# EAGLE design ThermocoupleTestBoard_2023_10_08_A (EAGLE 9.6.2)
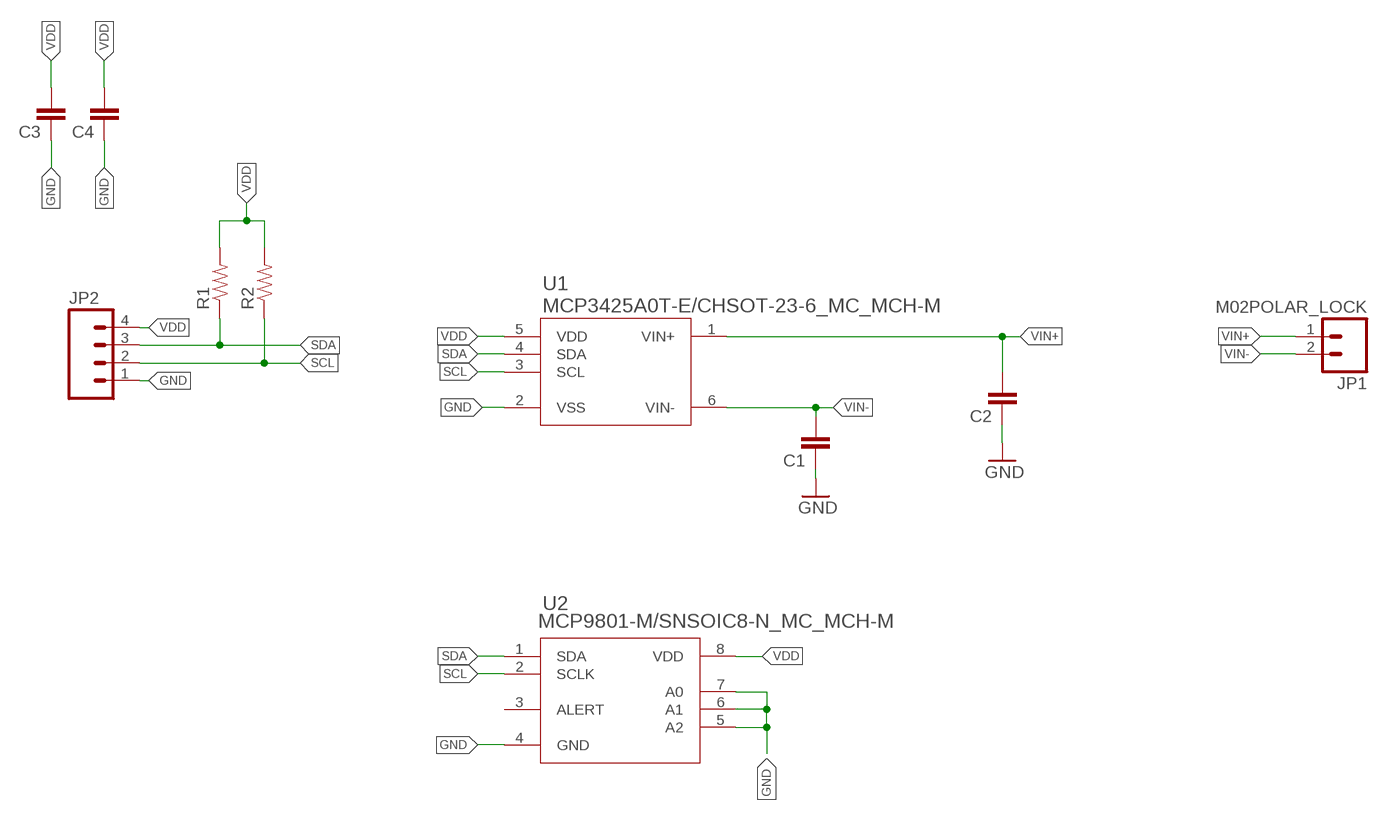
[diagram p0: schematic, sheet 1]

## Parts
C1  CAP1206  [1206]
C2  CAP1206  [1206]
C3  CAP1206  [1206]
C4  CAP1206  [1206]
JP1  M02POLAR_LOCK  [MOLEX-1X2_LOCK]
JP2  M04LOCK  [1X04_LOCK]
R1  RESISTOR1206  [1206]
R2  RESISTOR1206  [1206]
U1  MCP3425A0T-E/CHSOT-23-6_MC_MCH-M  [SOT-23-6_MC_MCH-M]
U2  MCP9801-M/SNSOIC8-N_MC_MCH-M  [SOIC8-N_MC_MCH-M]

## Nets
GND: C1.1 C2.1 C3.1 C4.1 JP2.1 U1.2(VSS) U2.4(GND) U2.5(A2) U2.6(A1) U2.7(A0)
SCL: JP2.2 R2.1 U1.3(SCL) U2.2(SCLK)
SDA: JP2.3 R1.1 U1.4(SDA) U2.1(SDA)
VDD: C3.2 C4.2 JP2.4 R1.2 R2.2 U1.5(VDD) U2.8(VDD)
VIN+: C2.2 JP1.1 U1.1(VIN+)
VIN-: C1.2 JP1.2 U1.6(VIN-)
Unconnected: U2.3(ALERT)

## Library data of the parts
C1-C4 = SparkFun-Capacitors:CAP: Capacitor Standard 0603 ceramic capacitor, and 0.1" leaded capacitor.
JP1 = SparkFun-Connectors:M02: Standard 2-pin 0.1" header. Use with - straight break away headers ( PRT-00116) - right angle break away headers (PRT-00553) - swiss pins (PRT-00743) - machine pins (PRT-00117) - female headers (PRT-00115) Molex polarized connector foot print use with: PRT-08233 with associated crimp pins and housings. 2.54_SCREWTERM for use with PRT-10571. 3.5mm Screw Terminal footprints for PRT-08084 5mm Screw Terminal footprints for use with PRT-08432
JP2 = SparkFun-Connectors:M04: Header 4 Standard 4-pin 0.1" header. Use with straight break away headers (SKU : PRT-00116), right angle break away headers (PRT-00553), swiss pins (PRT-00743), machine pins (PRT-00117), and female headers (PRT-00115). Molex polarized connector foot print use with SKU : PRT-08231 with associated crimp pins and housings. 1MM SMD Version SKU: PRT-10208
R1 R2 = SparkFun-Resistors:RESISTOR: Resistor Basic schematic elements and footprints for 0603, 1206, and PTH resistors.
U1 = MCP3425A0T:MCP3425A0T-E/CH: Analog to Digital Converters - ADC 16-B delta-sigma ADC Sngl Ch 15sps SOT-23-6; COPYRIGHT: Copyright (C) 2023 Ultra Librarian. All rights reserved.; MANUFACTURER_PART_NUMBER: MCP3425A0T-E/CH; MFR_NAME: Microchip
U2 = MCP9801MSN:MCP9801-M/SN; COPYRIGHT: Copyright (C) 2023 Ultra Librarian. All rights reserved.; MANUFACTURER_PART_NUMBER: MCP9801-M/SN; MFR_NAME: Microchip

## Board
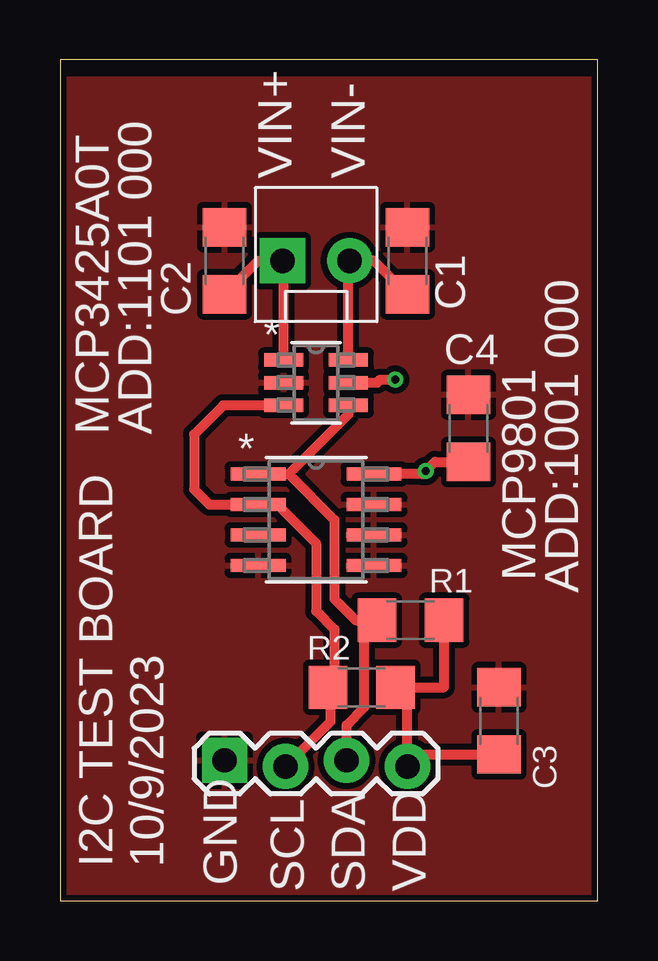
[diagram p1: board, top side]
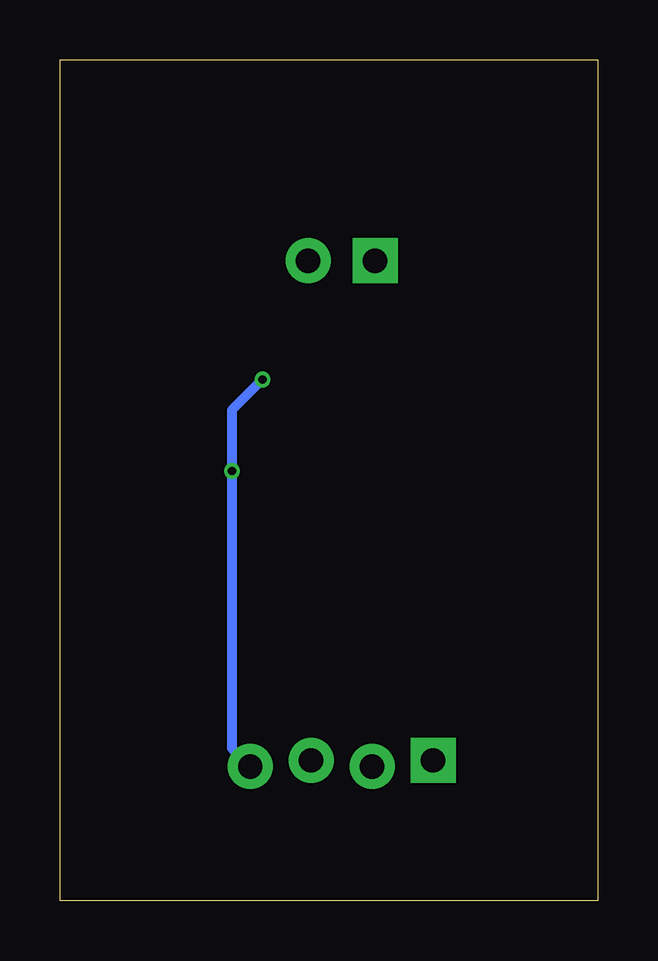
[diagram p2: board, bottom side, seen from below]

Size 22.4 x 35.04 mm. Coordinates in mm from the lower left corner, seen from the top.
Outline: 0,0 22.4,0 22.4,35.04 0,35.04 0,0
Copper layers (1*16): Top 0.035mm / dielectric 1.5mm / Bottom 0.035mm
Design rules "default": minimum track width 5mil, minimum drill 5mil, track to track 10mil, track to pad 10mil, pad to pad 10mil, via to via 10mil, smd to smd 6mil, copper to edge 10mil, drill to drill 6mil, minimum pad ring 6mil, minimum via ring 6mil, stop-mask expansion 4mil, vias tented up to drill 0mil, thermal gap 10mil

### Footprints (pad centres in the part's own frame; a part is rotated, then mirrored left to right if it is on the bottom)
1206 = smd 1.6 x 1.8: 1 -1.4,0; 2 1.4,0
MOLEX-1X2_LOCK = drill 1.016 pad 1.88 square: 1 -0.127,0 | drill 1.016 pad 1.88: 2 2.667,0
1X04_LOCK = drill 1.016 pad 1.88 square: 1 0,0.127 | drill 1.016 pad 1.88: 2 2.54,-0.127; 3 5.08,0.127; 4 7.62,-0.127
SOT-23-6_MC_MCH-M = smd 1.626 x 0.559: 1 -1.346,0.95; 2 -1.346,0; 3 -1.346,-0.95; 4 1.346,-0.95; 5 1.346,0; 6 1.346,0.95
SOIC8-N_MC_MCH-M = smd 2.286 x 0.559: 1 -2.413,1.905; 2 -2.413,0.635; 3 -2.413,-0.635; 4 -2.413,-1.905; 5 2.413,-1.905; 6 2.413,-0.635; 7 2.413,0.635; 8 2.413,1.905

### Placement (x,y rotation side)
C1  14.48,26.67 270 top
C2  6.86,26.67 270 top
C3  18.29,7.49 270 top
C4  17.02,19.68 270 top
JP1  9.4,26.67 0 top
JP2  6.86,5.71 0 top
R1  14.61,11.68 0 top
R2  12.57,8.89 0 top
U1  10.67,21.59 0 top
U2  10.67,15.88 0 top

### Tracks (layer width: path | path; a pad name or v marks a point on that pad's centre or on a via)
GND
  pour Top (isolate 0.254, rank 6): 0.51,34.29 22.73,34.29 22.73,-7.62 -0.13,-7.62 -0.13,34.29
SCL
  Top 0.406: U1.3 6.8,20.64 5.59,19.43 5.59,17.14 6.22,16.51 U2.2 9.05,16.51 10.67,14.9 10.67,12.07 11.43,11.3 11.43,9.15 11.28,9 | 11.28,9 R2.1 | JP2.2 11.28,7.47 11.28,9
SDA
  Top 0.406: JP2.3 11.94,7.31 12.68,8.06 12.68,11.68 R1.1 12.32,11.68 11.43,12.57 11.43,15.88 9.52,17.78 | 9.52,17.78 12.01,20.27 U1.4 | U2.1 9.52,17.78
VDD  (via drill 0.35)
  Top 0.406: U1.5 13.21,21.59 13.34,21.72 v13.97,21.72 | U2.8 15.11,17.78 v15.24,17.91 15.62,18.29 C4.2 | R1.2 16.01,8.89 R2.2 14.48,8.39 JP2.4 14.98,6.09 C3.2
  Bottom 0.406: v13.97,21.72 15.24,20.45 v15.24,17.91 15.24,6.35 JP2.4
VIN+
  Top 0.406: C2.2 8.26,26.67 JP1.1 9.32,26.62 U1.1
VIN-
  Top 0.406: C1.2 13.08,26.67 JP1.2 12.01,26.62 U1.6

### Text on the board
tPlace: VIN+ | VIN- | MCP3425A0T | ADD:1101 000 | MCP9801 | ADD:1001 000 | I2C TEST BOARD / 10/9/2023 | GND | SCL | SDA | VDD